# EAGLE design GeigerHVCircuit (EAGLE 5.11)
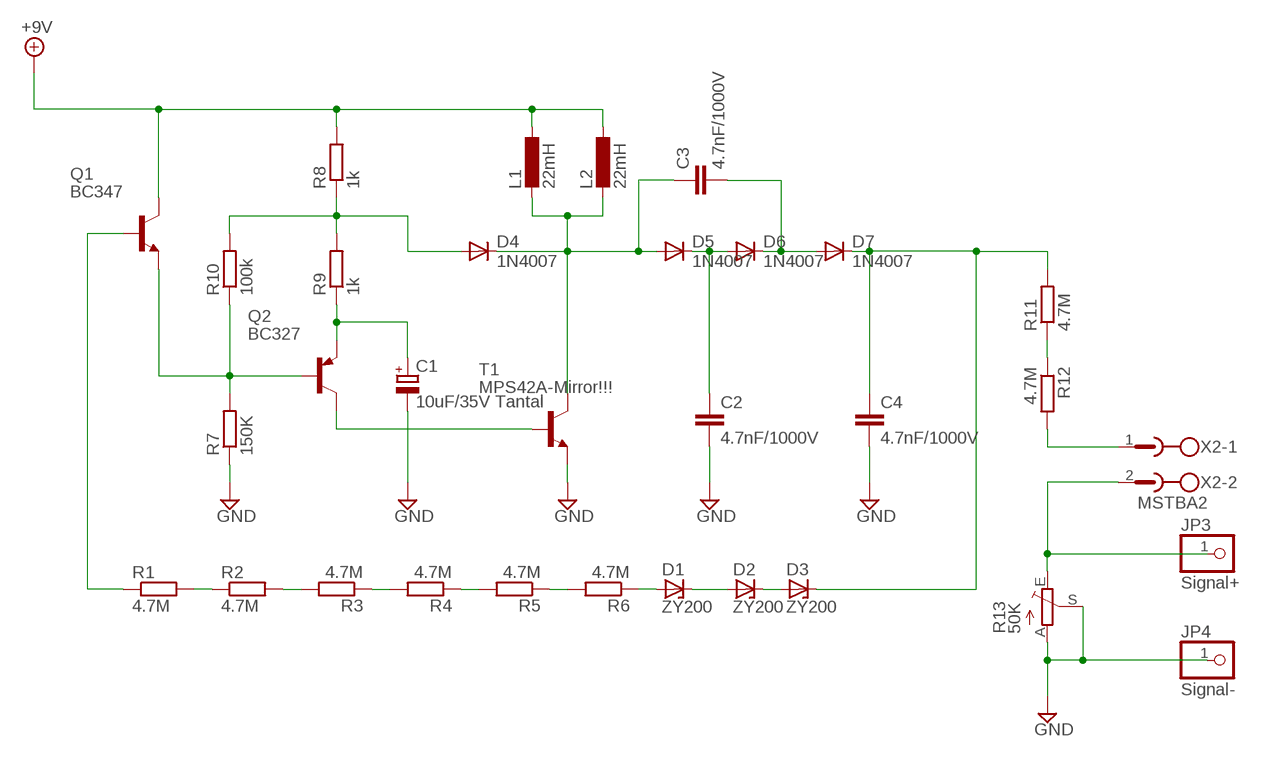
[diagram p0: schematic, sheet 1]

## Parts
C1  10uF/35V Tantal  CPOL-EUETR4  [ETR4]
C2  4.7nF/1000V  C10/4  [C10B4]
C3  4.7nF/1000V  C10/4  [C10B4]
C4  4.7nF/1000V  C10/4  [C10B4]
D1  ZY200  ZY  [P1Z12]
D2  ZY200  ZY  [P1Z12]
D3  ZY200  ZY  [P1Z12]
D4  1N4007  1N4004  [DO41-10]
D5  1N4007  1N4004  [DO41-10]
D6  1N4007  1N4004  [DO41-10]
D7  1N4007  1N4004  [DO41-10]
JP3  Signal+  PINHD-1X1  [1X01]
JP4  Signal-  PINHD-1X1  [1X01]
L1  22mH  L-EU2200-15.24  [2200-15.24]
L2  22mH  L-EU2200-15.24  [2200-15.24]
Q1  BC347  BC337  [TO92]
Q2  BC327  [TO92]
R1  4.7M  R-EU_0207/2V  [0207/2V]
R2  4.7M  R-EU_0207/2V  [0207/2V]
R3  4.7M  R-EU_0207/2V  [0207/2V]
R4  4.7M  R-EU_0207/2V  [0207/2V]
R5  4.7M  R-EU_0207/2V  [0207/2V]
R6  4.7M  R-EU_0207/2V  [0207/2V]
R7  150K  R-EU_0207/10  [0207/10]
R8  1k  R-EU_0207/2V  [0207/2V]
R9  1k  R-EU_0207/2V  [0207/2V]
R10  100k  R-EU_0207/12  [0207/12]
R11  4.7M  R-EU_0207/12  [0207/12]
R12  4.7M  R-EU_0207/12  [0207/12]
R13  50K  TRIM_EU-S64Y  [S64Y]
T1  MPS42A-Mirror!!!  BC337  [TO92]
X2  MSTBA2  [MSTBA2]

## Nets
+9V: L1.1 L2.1 Q1.3(C) R8.2
GND: C1.- C2.2 C4.2 JP4.1 R7.1 R13.A R13.S T1.1(E)
N$1: R1.2 R2.1
N$2: R2.2 R3.2
N$3: R3.1 R4.2
N$4: R4.1 R5.2
N$5: R5.1 R6.2
N$6: D1.A R6.1
N$7: D1.C D2.A
N$8: D2.C D3.A
N$9: JP3.1 R13.E X2.2
N$10: Q1.1(E) Q2.2(B) R7.2 R10.1
N$11: D4.A R8.1 R9.2 R10.2
N$12: C1.+ Q2.1(E) R9.1
N$13: C2.1 D5.C D6.A
N$14: C3.2 D6.C D7.A
N$15: Q1.2(B) R1.1
N$16: C3.1 D4.C D5.A L1.2 L2.2 T1.3(C)
N$17: Q2.3(C) T1.2(B)
N$18: R11.1 R12.1
N$19: R12.2 X2.1
N$20: C4.1 D3.C D7.C R11.2

## Library data of the parts
C1 = resistor:CPOL-EU: POLARIZED CAPACITOR, European symbol
C2-C4 = capacitor-wima:C: CAPACITOR naming: grid - package width
D1-D3 = diode:ZY: Z DIODE
D4-D7 = diode:1N4004: DIODE general purpose rectifier, 1 A
JP3 JP4 = pinhead:PINHD-1X1: PIN HEADER
L1 L2 = resistor:L-EU: INDUCTOR, European symbol
Q1 = transistor-npn:BC337*: NPN Transistor
Q2 = transistor-pnp:BC327: PNP Transistor
R1-R12 = resistor:R-EU_: RESISTOR, European symbol
R13 = pot:TRIM_EU-: POTENTIOMETER
T1 = transistor:BC337: NPN TRANSISTOR
X2 = con-phoenix-508:MSTBA2: PHOENIX; MF: FARNELL; MPN: 1757242; OC_FARNELL: 3705171; OC_NEWARK: 71C4161

## Board
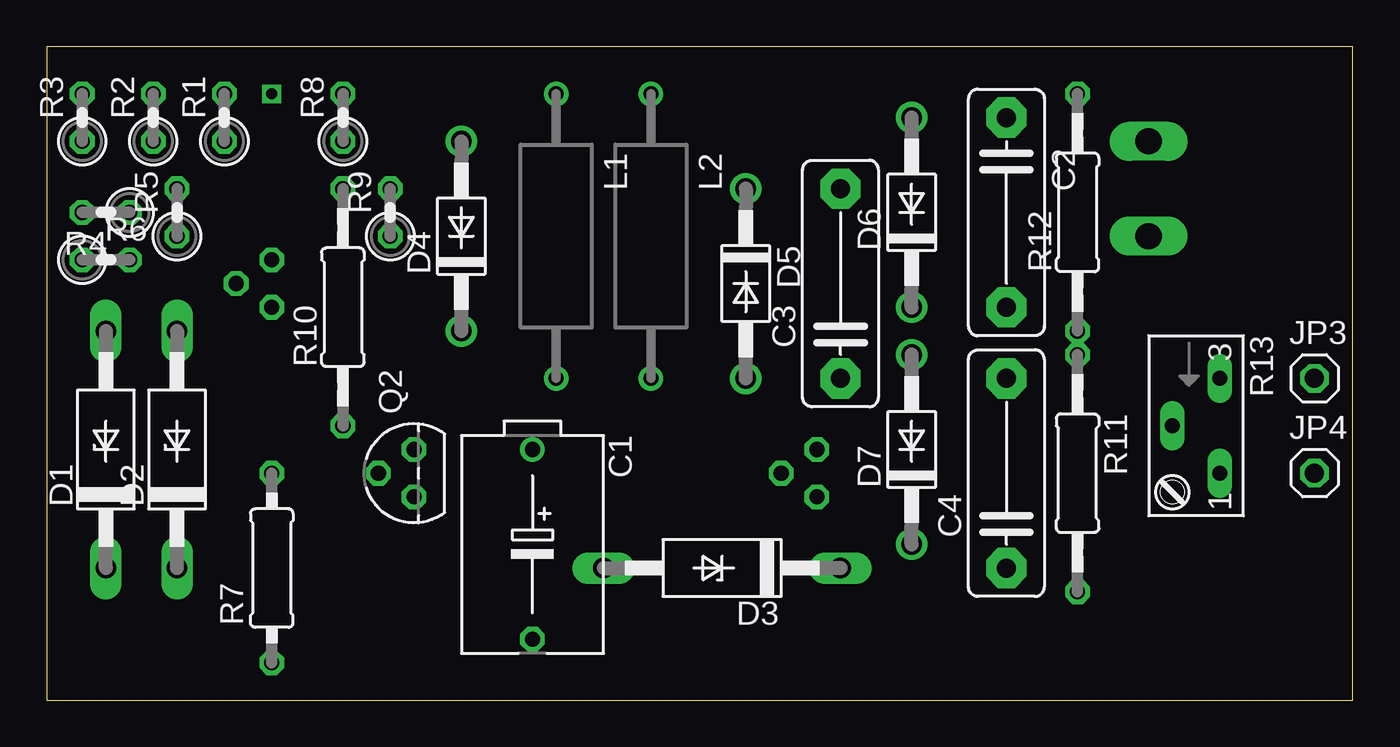
[diagram p1: board, top side]
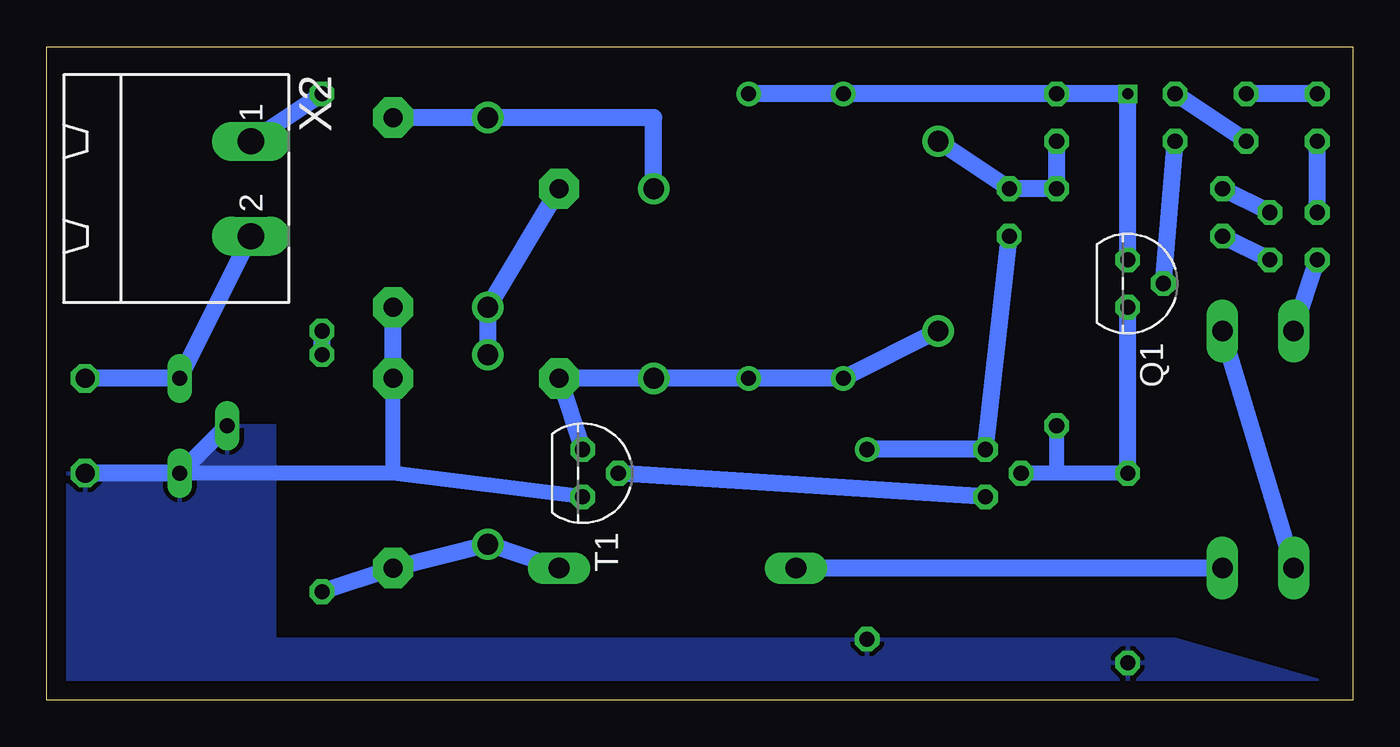
[diagram p2: board, bottom side, seen from below]

Size 70 x 35 mm. Coordinates in mm from the lower left corner, seen from the top.
Outline: 0,0 70,0 70,35 0,35 0,0
Copper layers (1*16): Top 0.035mm / dielectric 1.5mm / Bottom 0.035mm
Design rules "default *": minimum track width 15mil, minimum drill 24mil, track to track 8mil, track to pad 8mil, pad to pad 8mil, via to via 8mil, smd to smd 8mil, copper to edge 40mil, drill to drill 8mil, minimum pad ring 10mil, minimum via ring 8mil, stop-mask expansion 4mil, vias tented up to drill 0mil, thermal gap 10mil

### Footprints (pad centres in the part's own frame; a part is rotated, then mirrored left to right if it is on the bottom)
ETR4 = drill 0.813 round: + -5.08,0 | drill 0.813 octagon: - 5.08,0
C10B4 = drill 1.016 pad 2.159 octagon: 1 -5.08,0; 2 5.08,0
P1Z12 = drill 1.118 long: A 6.35,0; C -6.35,0
DO41-10 = drill 1.118 round: A 5.08,0; C -5.08,0
1X01 = drill 1.016 octagon: 1 0,0
2200-15.24 = drill 0.8 pad 1.27 round: 1 -7.62,0; 2 7.62,0
TO92 = drill 0.813 octagon: 1 1.27,0; 2 0,1.905; 3 -1.27,0
0207/2V = drill 0.813 octagon: 1 -1.27,0; 2 1.27,0
0207/10 = drill 0.813 octagon: 1 -5.08,0; 2 5.08,0
0207/12 = drill 0.813 octagon: 1 -6.35,0; 2 6.35,0
S64Y = drill 0.813 long: A 2.54,1.27; E -2.54,1.27; S 0,-1.27
MSTBA2 = drill 1.397 long: 1 -2.54,5.08; 2 2.54,5.08

### Placement (x,y rotation side)
C1  26.04,8.34 270 top
C2  51.44,26.12 270 top
C3  42.55,22.31 90 top
C4  51.44,12.15 90 top
D1  3.18,13.42 90 top
D2  6.98,13.42 90 top
D3  36.19,7.07 180 top
D4  22.22,24.85 90 top
D5  37.47,22.31 270 top
D6  46.36,26.12 90 top
D7  46.36,13.42 90 top
JP3  67.94,17.23 0 top
JP4  67.94,12.15 0 top
L1  27.3,24.85 270 top
L2  32.39,24.85 270 top
Q1  12.07,22.31 270 bottom
Q2  19.68,12.15 90 top
R1  9.52,31.2 90 top
R2  5.71,31.2 90 top
R3  1.91,31.2 90 top
R4  3.18,26.12 180 top
R5  6.98,26.12 90 top
R6  3.18,23.58 0 top
R7  12.07,7.07 90 top
R8  15.88,31.2 90 top
R9  18.42,26.12 90 top
R10  15.88,21.04 90 top
R11  55.24,12.15 270 top
R12  55.24,26.12 90 top
R13  61.59,14.69 270 top
T1  41.28,12.15 270 bottom
X2  64.13,27.39 270 bottom

### Tracks (layer width: path | path; a pad name or v marks a point on that pad's centre or on a via)
+9V  (via drill 0.6)
  Bottom 0.9: L2.1 L1.1 R8.2 v12.07,32.47 Q1.3
GND
  Bottom 0.813: 51.44,12.15 C4.2 51.44,12.15 | 51.44,12.15 57.78,12.15 R13.A | T1.1 51.44,12.15
  Bottom 0.9: R13.S 60.96,14.05 R13.A JP4.1 | C4.2 C2.2
  pour Bottom: 0.63,0.72 9.52,3.26 57.78,3.26 57.78,14.69 60.33,14.69 62.86,12.15 69.21,12.15 69.21,0.72
N$1
  Bottom 0.9: R2.1 R1.2
N$2
  Bottom 0.9: R3.2 R2.2
N$3
  Bottom 0.9: R4.2 R3.1
N$4
  Bottom 0.9: R4.1 R5.2
N$5
  Bottom 0.9: R6.2 R5.1
N$6
  Bottom 0.9: D1.A R6.1
N$7
  Bottom 0.9: D1.C D2.A
N$8
  Bottom 0.9: D2.C D3.A
N$9
  Bottom 0.406: R13.E JP3.1
  Bottom 0.9: JP3.1 R13.E X2.2
N$10
  Bottom 0.813: R7.2 15.88,12.15 | 15.88,12.15 Q2.2 | 15.88,12.15 R10.1
  Bottom 0.9: R7.2 Q1.1
N$11
  Bottom 0.9: D4.A R9.2 R10.2 R8.1
N$12
  Bottom 0.9: C1.+ Q2.1 R9.1
N$13
  Bottom 0.9: D5.C 37.47,31.2 45.08,31.2 | 45.08,31.2 D6.A | 45.08,31.2 C2.1
N$14
  Bottom 0.9: C3.2 D6.C D7.A
N$15
  Bottom 0.9: Q1.2 R1.1
N$16
  Bottom 0.9: D4.C L1.2 L2.2 D5.A C3.1 T1.3
N$17
  Bottom 0.9: Q2.3 T1.2
N$18
  Bottom 0.9: R11.1 R12.1
N$19
  Bottom 0.9: X2.1 R12.2
N$20
  Bottom 0.9: D3.C D7.C C4.1 R11.2